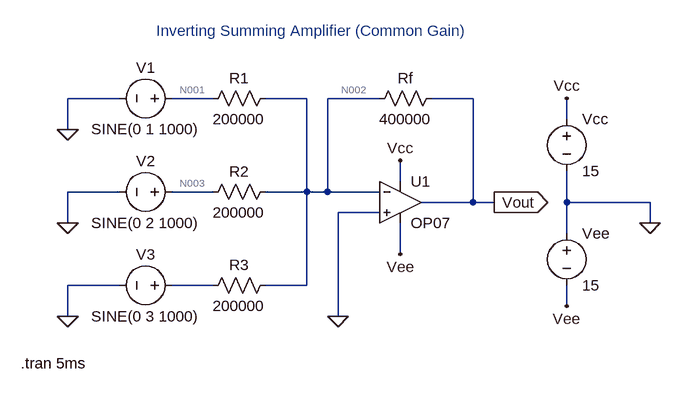
[diagram p0: schematic Assignment 7b.asc]
Assignment 7b.asc, the LTspice schematic file:
Version 4
SHEET 1 880 680
WIRE -208 16 -288 16
WIRE -64 16 -128 16
WIRE 80 16 16 16
WIRE 192 16 112 16
WIRE 336 16 272 16
WIRE 480 48 480 16
WIRE -288 64 -288 16
WIRE 224 144 224 112
WIRE -208 160 -288 160
WIRE -64 160 -128 160
WIRE 80 160 80 16
WIRE 80 160 16 160
WIRE 112 160 112 16
WIRE 112 160 80 160
WIRE 192 160 112 160
WIRE 336 176 336 16
WIRE 336 176 256 176
WIRE 368 176 336 176
WIRE 480 176 480 128
WIRE 608 176 480 176
WIRE 192 192 128 192
WIRE -288 208 -288 160
WIRE 608 208 608 176
WIRE 480 224 480 176
WIRE 224 256 224 208
WIRE -208 304 -288 304
WIRE -64 304 -128 304
WIRE 80 304 80 160
WIRE 80 304 16 304
WIRE 480 336 480 304
WIRE -288 352 -288 304
WIRE 128 352 128 192
FLAG 128 352 0
FLAG 608 208 0
FLAG 480 16 Vcc
FLAG 224 112 Vcc
FLAG 480 336 Vee
FLAG 224 256 Vee
FLAG 368 176 Vout
IOPIN 368 176 Out
FLAG -288 64 0
FLAG -288 208 0
FLAG -288 352 0
SYMBOL Opamps\\OP07 224 112 R0
SYMATTR InstName U1
SYMBOL voltage 480 32 R0
WINDOW 123 0 0 Left 2
WINDOW 39 0 0 Left 2
SYMATTR InstName Vcc
SYMATTR Value 15
SYMBOL voltage 480 208 R0
WINDOW 123 0 0 Left 2
WINDOW 39 0 0 Left 2
SYMATTR InstName Vee
SYMATTR Value 15
SYMBOL res 32 144 R90
WINDOW 0 0 56 VBottom 2
WINDOW 3 32 56 VTop 2
SYMATTR InstName R2
SYMATTR Value 200000
SYMBOL res 32 0 R90
WINDOW 0 0 56 VBottom 2
WINDOW 3 32 56 VTop 2
SYMATTR InstName R1
SYMATTR Value 200000
SYMBOL res 32 288 R90
WINDOW 0 0 56 VBottom 2
WINDOW 3 32 56 VTop 2
SYMATTR InstName R3
SYMATTR Value 200000
SYMBOL voltage -112 16 R90
WINDOW 0 -32 56 VBottom 2
WINDOW 3 32 56 VTop 2
WINDOW 123 0 0 Left 2
WINDOW 39 0 0 Left 2
SYMATTR InstName V1
SYMATTR Value SINE(0 1 1000)
SYMBOL voltage -112 160 R90
WINDOW 0 -32 56 VBottom 2
WINDOW 3 32 56 VTop 2
WINDOW 123 0 0 Left 2
WINDOW 39 0 0 Left 2
SYMATTR InstName V2
SYMATTR Value SINE(0 2 1000)
SYMBOL voltage -112 304 R90
WINDOW 0 -32 56 VBottom 2
WINDOW 3 32 56 VTop 2
WINDOW 123 0 0 Left 2
WINDOW 39 0 0 Left 2
SYMATTR InstName V3
SYMATTR Value SINE(0 3 1000)
SYMBOL res 288 0 R90
WINDOW 0 0 56 VBottom 2
WINDOW 3 32 56 VTop 2
SYMATTR InstName Rf
SYMATTR Value 400000
TEXT -152 -88 Left 2 ;Inverting Summing Amplifier (Common Gain)
TEXT -360 424 Left 2 !.tran 5ms

The netlist it stands for:
* Assignment 7b.asc
XU1 0 N002 Vcc Vee Vout LT1001  ; OP07, pins In+ In- V+ V- OUT
Vcc Vcc 0 15
Vee 0 Vee 15
R2 N002 N003 200000
R1 N002 N001 200000
R3 N002 N004 200000
V1 N001 0 SINE(0 1 1000)
V2 N003 0 SINE(0 2 1000)
V3 N004 0 SINE(0 3 1000)
Rf Vout N002 400000
* Inverting Summing Amplifier (Common Gain)
.tran 5ms
.lib LTC.lib
.backanno
.end

* Results of the author's LTspice run, read from the files saved beside the schematic
* Operating Point, zero values left out:
*   V(vcc) = 15 V
*   V(vee) = -15 V
*   I(Vcc) = -2.25 mA
*   I(Vee) = -2.25 mA
*   Ix(u1:3) = 2.25 mA
*   Ix(u1:4) = -2.25 mA
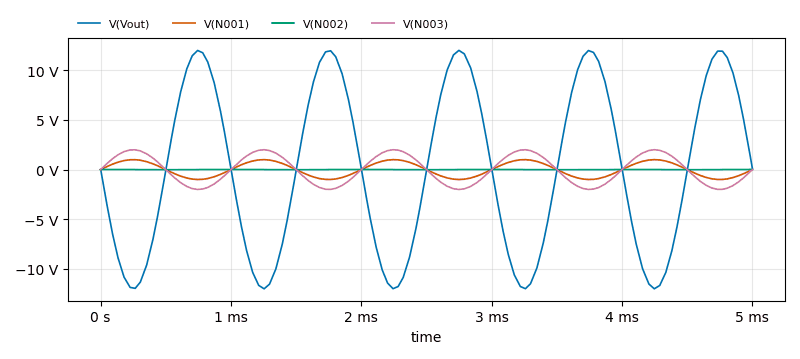
[diagram p1: Transient Analysis of Assignment 7b.asc, plotted from the saved traces]
* Transient Analysis, 1 run:
*   V(Vout): min -12 V, max 12 V, average 471.6 µV, rms 8.468 V, last 101.8 mV
*   V(N001): min -999.9 mV, max 999.9 mV, average -41.03 µV, rms 705.7 mV, last 0 V
*   V(N002): min -14.53 mV, max 14.53 mV, average -3.308 µV, rms 10.21 mV, last 14.53 mV
*   V(N003): min -2 V, max 2 V, average -82.07 µV, rms 1.411 V, last 0 V